# Altium schematic sheet EMI Schematic.SchDoc
size A4; SheetNumber: 1; SheetTotal: 1
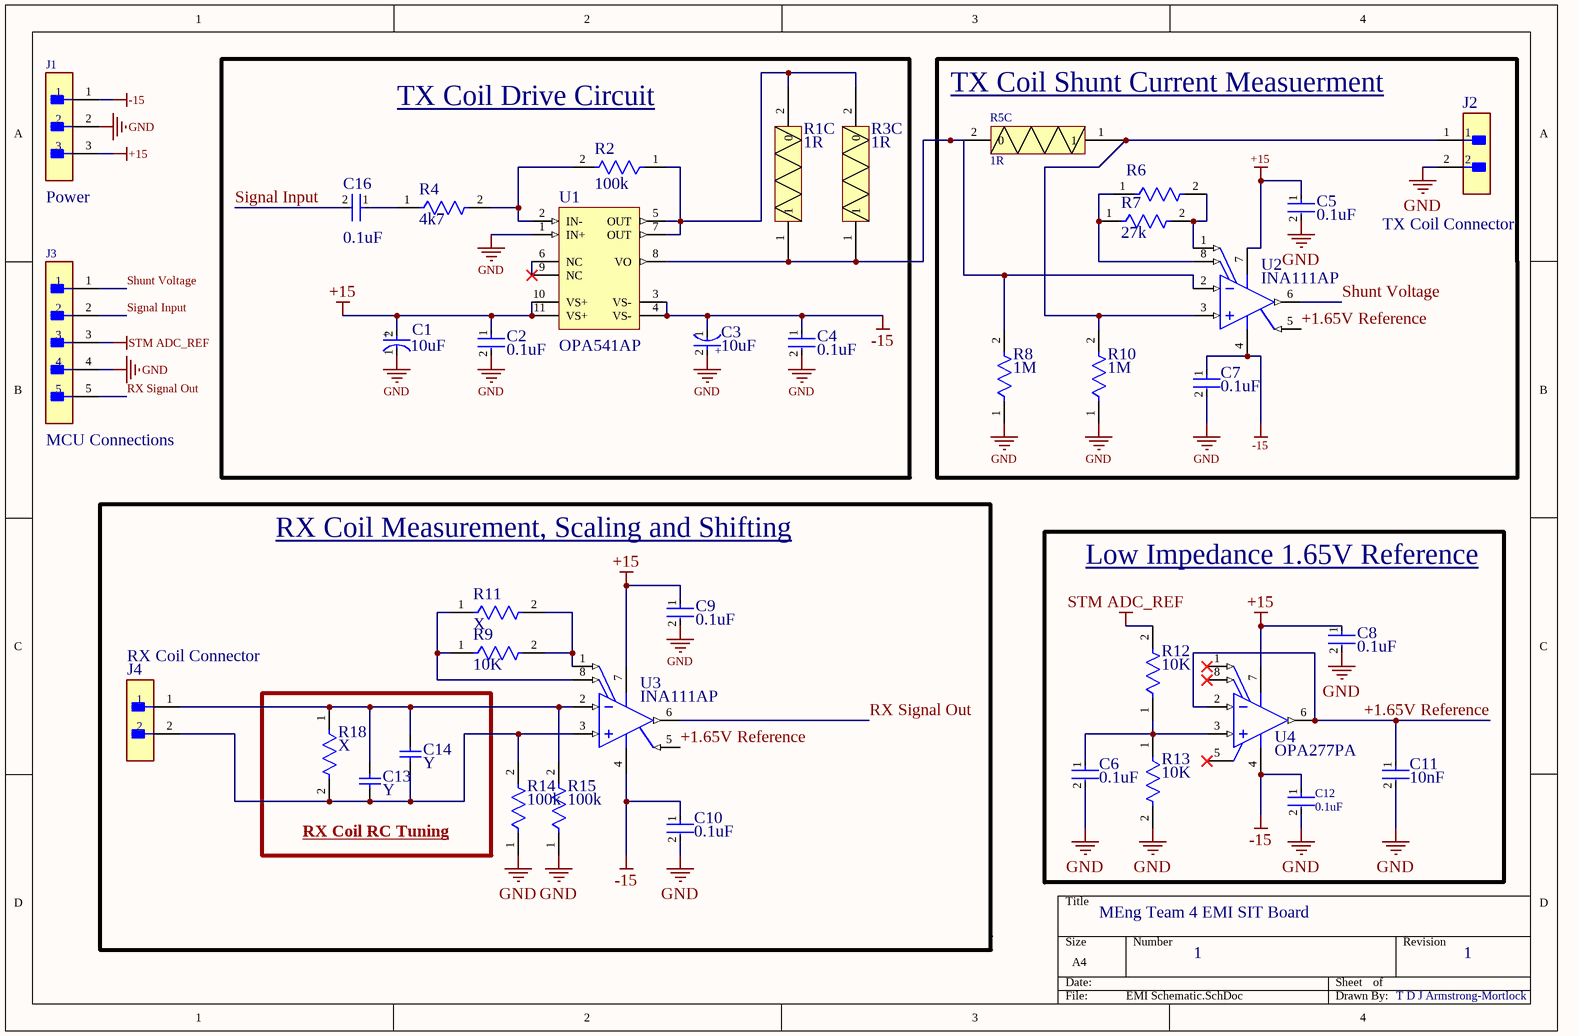
[diagram p0: EMI Schematic.SchDoc]

## Parts
C1  10uF  [FP-RAD-TH-D_5_0_5-L_11_1-MFG]
C2  0.1uF  [FP-K15H5-MFG]
C3  10uF  [FP-RAD-TH-D_5_0_5-L_11_1-MFG]
C4  0.1uF  [FP-K15H5-MFG]
C5  0.1uF  [FP-K15H5-MFG]
C6  0.1uF  [FP-K15H5-MFG]
C7  0.1uF  [FP-K15H5-MFG]
C8  0.1uF  [FP-K15H5-MFG]
C9  0.1uF  [FP-K15H5-MFG]
C10  0.1uF  [FP-K15H5-MFG]
C11  10nF  [FP-K15H5-MFG]
C12  0.1uF  [FP-K15H5-MFG]
C13  Y  [CAPC2013X145X48ML20T23]
C14  Y  [CAPC2013X145X48ML20T23]
C16  0.1uF  [FP-K15H5-MFG]
J1  Power  [FP-09-65-2038-MFG]
J2  TX Coil Connector  [FP-26-61-4020-MFG]
J3  MCU Connections  [FP-22-28-4050-MFG]
J4  RX Coil Connector  [FP-26-61-4020-MFG]
R1  1R  [PRO3 0617]  (part C of 3)
R2  100k  [FP-RT0805-MFG]
R3  1R  [PRO3 0617]  (part C of 3)
R4  4k7  [FP-RT0805-MFG]
R5  1R  [PRO3 0617]  (part C of 3)
R6  (no value)  [FP-RT0805-MFG]
R7  27k  [FP-RT0805-MFG]
R8  1M  [FP-RT0805-MFG]
R9  10K  [FP-RT0805-MFG]
R10  1M  [FP-RT0805-MFG]
R11  X  [FP-RT0805-MFG]
R12  10K  [FP-RT0805-MFG]
R13  10K  [FP-RT0805-MFG]
R14  100k  [FP-RT0805-MFG]
R15  100k  [FP-RT0805-MFG]
R18  X  [FP-RT0805-MFG]
U1  OPA541AP  [KV0011A]
U2  INA111AP  [P0008A]
U3  INA111AP  [P0008A]
U4  OPA277PA  [P0008A]

## Blocks framed on the sheet
TX Coil Drive Circuit: C1-C4 C16 R1-R4 U1
TX Coil Shunt Current Measuerment: C5 C7 J2 R5-R8 R10 U2
RX Coil Measurement, Scaling and Shifting: C9 C10 J4 R9 R11 R14 R15 U3
Low Impedance 1.65V Reference: C6 C8 C11 C12 R12 R13 U4
RX Coil RC Tuning: C13 C14 R18

## Nets
+15: C1.2(A) C2.1 C5.1 C8.1 C9.1 J1.3 U1.10(VS+) U1.11(VS+) U2.7(V+) U3.7(V+) U4.7(V+)
-15: C3.1(C) C4.1 C7.1 C10.1 C12.1 J1.1 U1.3(VS-) U1.4(VS-) U2.4(V-) U3.4(V-) U4.4(V-)
GND: C1.1(C) C2.2 C3.2(A) C4.2 C5.2 C6.2 C7.2 C8.2 C9.2 C10.2 C11.2 C12.2 J1.2 J2.2 J3.4 R8.1 R10.1 R13.2 R14.1 R15.1 U1.1(IN+)
STM ADC_REF: J3.3 R12.2
+1.65V Reference: C11.1 U2.5(REF) U3.5(REF) U4.2(IN-) U4.6(OUT)
RX Signal Out: J3.5 U3.6(VO)
Shunt Voltage: J3.1 U2.6(VO)
Signal Input: C16.2 J3.2
NetC6_1: C6.1 R12.1 R13.1 U4.3(IN+)
NetC13_1: C13.1 C14.1 J4.1 R15.2 R18.1 U3.2(VIN-)
NetC13_2: C13.2 C14.2 J4.2 R14.2 R18.2 U3.3(VIN+)
NetC16_1: C16.1 R4.1
NetJ2_1: J2.1 R5.1 R10.2 U2.3(VIN+)
NetR1_1: R1.1 R3.1 R5.2(0) R8.2 U1.8(VO) U2.2(VIN-)
NetR1_2: R1.2(0) R2.1 R3.2(0) U1.5(OUT) U1.7(OUT)
NetR2_2: R2.2 R4.2 U1.2(IN-)
NetR6_1: R6.1 R7.1 U2.8(RG)
NetR6_2: R6.2 R7.2 U2.1(RG)
NetR9_1: R9.1 R11.1 U3.8(RG)
NetR9_2: R9.2 R11.2 U3.1(RG)
NetU1_6: U1.6(NC) U1.9(NC)

Not connected (* = marked no-connect by the designer): U4 1(OFFSET_TRIM)* 5(NC)* 8(OFFSET_TRIM)*

## Notes on the sheet
- MEng Team 4 EMI SIT Board
- 1
- T D J Armstrong-Mortlock
- (in symbol CMP-05427-000260-1) +

## Library data of the parts
C1 C3 = CMP-05427-000260-1: Aluminum Electrolytic Capacitors (Radial Lead Type) AEC-Q200 Qualified 10uF ±20% 50V; Lead Diameter: 0.5mm; Polarity: Polar; Leakage Current: 3uA; Life (Hours): 1000Hour; Ripple Current: 39mA; Lead/Base Style: Straight; Max Operating Temperature: 105°C; Voltage Rating (DC): 50V; Diameter: 5mm; RoHS Compliant: Yes; Capacitance: 10uF; Packaging: Ammo Pack; Series: NHG; Construction: RADIAL; Length: 11mm; Tolerance: 20%; Height - Seated (Max): 0.472inch; Contact Plating: Tin; Height: 11mm; Min Operating Temperature: -55°C; Radiation Hardening: No; Package Quantity: 2000; Mount: Through Hole; Voltage Rating: 50V; Lead Pitch: 2.5mm; Termination: Radial; Lead Free: Lead Free; Case/Package: Radial
C2 C4-C12 C16 = CMP-02417-000048-1: CAP CER 0.1UF 50V X7R RADIAL; Capacitance: 100nF; Tolerance: 10%; Lead/Base Style: Formed Leads; Lead Length: 30mm; Lead Diameter: 0.5mm; Radiation Hardening: No; Lead Pitch: 5mm; Voltage: 50V; Mount: Through Hole; Package Quantity: 5000; Series: K; Case/Package: Dipped; Min Operating Temperature: -55°C; Depth: 2.5mm; Height - Seated (Max): 0.1inch; Voltage Rating (DC): 50V; Packaging: Bulk; RoHS Compliant: Yes; Construction: RADIAL; Thickness: 2.6mm; Max Operating Temperature: 125°C; Voltage Rating: 50V; Diameter: 500um; Dielectric: X7R; Width: 2.5mm; Length: 4mm; Weight: 0.005644oz; Termination: Radial; Height: 4mm
C13 C14 = CMP-2007-03205-1: Manufacturer: Vitramon; Part Number: VJ0805Y682KXAMT
J1 = CMP-04776-000251-1: CONN HEADER VERT 3POS 3.96MM; Max Voltage Rating (AC): 250V; Gender: Male; Glow Wire Compliant: Non-compliant; Number of Contacts: 3; Contact Resistance: 10mR; Current Rating: 7A; Mating Cycles: 30; Pitch: 3.96mm; Radiation Hardening: No; Lead Free: Lead Free; Termination: Through Hole; Orientation: Straight; Housing Material: Nylon; RoHS Compliant: Yes; Number of Rows: 1; Color: Natural; Contact Material: Brass; Voltage Rating: 250V; Flammability Rating: UL94 V-2; Contact Gender: Male; Number of Positions: 3; Min Operating Temperature: -40°C; Package Quantity: 8000; Packaging: Bulk; Mount: Through Hole; Series: 5273; Contact Plating: Tin; Max Operating Temperature: 105°C; Halogen Free: Halogen Free; Housing Color: Natural; Voltage Rating (DC): 250V
J2 J4 = CMP-00257-00277943-1: 26-61-4020 3.96mm (.156") Pitch KK® Solid Header, Vertical, Friction Lock, 2 Circuits, Gold (Au) Plating; NexarPartId: 277943; Manufacturer Lifecycle Status: ACTIVE; Number of Positions: 2; Contact Resistance: 6mΩ; Voltage Rating (DC): 250V; Glow Wire Compliant: Non-compliant; Max Current Rating: 7A; Insulation Resistance: 50GΩ; Gender: Male; Pitch: 3.96mm; Orientation: Right Angle, Vertical; Number of Circuits: 2; Length: 7.77mm; Depth: 10.01mm; Min Operating Temperature: 0°C; Mount: Through Hole; Lifecycle Status: Production; Lead Pitch: 3.96mm; Packaging: Bulk; Voltage Rating: 250V; Flammability Rating: UL94 V-0; Schedule B: 8536694040; Country of Origin: US; Contact Plating: Gold; Housing Color: Natural; Lead Free: Lead Free; Housing Material: Polyester; RoHS: Compliant; Color: Natural; Contact Material: Brass; REACH SVHC: Unknown; Number of Contacts: 2; Number of Rows: 1; Height: 14.73mm; Current Rating: 7A; Termination: Solder; Max Operating Temperature: 75°C; Max Voltage Rating (AC): 250V; Radiation Hardening: No
J3 = CMP-00257-00278173-1: 22-28-4050 KK® 254 Breakaway Header, Vertical, 5 Circuits, Tin (Sn) Plating, Mating Pin Length 6.09mm; NexarPartId: 278173; Voltage Rating: 250V; Number of Contacts: 5; Contact Resistance: 20mΩ; Gender: Male; Pitch: 2.54mm; Connector Type: Male Pin; Current Rating: 4A; Glow Wire Compliant: Non-compliant; Max Voltage Rating (DC): 250.25kV; Flammability Rating: UL94 V-0; Min Operating Temperature: 0°C; REACH SVHC: Unknown; Lead Free: Lead Free; Termination: Solder; RoHS: Compliant; Schedule B: 8536694040; Number of Circuits: 5; Mount: Through Hole; Lead Pitch: 2.54mm; Height: 2.29mm; Voltage Rating (DC): 250V; Max Operating Temperature: 75°C; Width: 2.49mm; Radiation Hardening: No; Contact Plating: Tin; Orientation: Vertical; Length: 12.7mm; Number of Rows: 1; Housing Material: Thermoplastic; Contact Material: Brass; Packaging: Bulk; Contact Mating Length: 6.096mm; Housing Color: Black; Color: Black; Number of Positions: 5
R1 R3 R5 = R?: 1 ohm 3w
R2 R4 R6-R15 R18 = CMP-03412-002763-1: RES SMD 681 OHM 0.1% 1/8W 0805; Manufacturer: Yageo; Manufacturer Part Number: RT0805BRD07681RL; Value: 681Ω; Temperature Coefficient: 25 ppm/°C; Power Rating: 0.125W; Voltage Rating: 150V; Tolerance: 0.0025; ComponentLink2URL: http://www.yageo.com/documents/recent/PYu-RT_1-to-0.01_RoHS_L_9.pdf; Ipc Land Pattern Name: RESC200125X50; Footprint Url: http://www.yageo.com/exep/pages/download/literatures/PYu-R_Mount_10.pdf; Temperature: -55°C to +155°C; Resistance: 681Ω; Mouser Description: Thin Film Resistors - SMD 1/8W 681 ohm .1% 25ppm; Temperature Range High: +155°C; Device Class L3: Chip SMD Resistors; Automotive: No; Octopart: https://octopart.com/rt0805brd07681rl-yageo-1270194; Device Class L1: Passive Components; Package: RT0805; Device Class L2: Resistors; Category: Res; RoHS: TRUE; Composition: Thin Film; ComponentLink2Description: Datasheet; Temperature Range Low: -55°C; Lead Free: Yes; Digikey Description: RES SMD 681 OHM 0.1% 1/8W 0805; Height: 0.6mm; Series: RT
U1 = CMP-0272-03690-4: High Power Monolithic Operational Amplifier, 20 to 70 V, -25 to 85 degC, 11-pin FM (KV11), Green (RoHS & no Sb/Br); Manufacturer: Texas Instruments; Rating: Catalog; Packing: TUBE; Slew Rate(Typ)(V/us): 10; GBW(Typ)(MHz): 1.6; Total Supply Voltage(Max)(+5V is 5, +/-5V is 10): 70; Number of Channels: 1; Sub Family: High Output Current Amplifier (>=50mA), High Supply Voltage Amplifier (>=30V), Precision Amplifier; Offset Drift(Typ)(uV/C): 20; IIB(Max)(pA): 50; CMRR(Min)(dB): 95; Iq per channel(Max)(mA): 25; ComponentLink2URL: http://www.ti.com/lit/ds/symlink/opa541.pdf; ComponentLink1URL: http://www.ti.com/; PartNumber: OPA541AP; PackageReference: KV0011A; PackageDescription: 11-Pin Plastic Flange Mount, Body 20.015 x 4.495 mm, Pitch 1.7 mm; ComponentLink1Description: Manufacturer URL; DatasheetVersion: SBOS153A; Total Supply Voltage(Min)(+5V is 5, +/-5V is 10): 20; ComponentLink2Description: Datasheet; Vio (25C)(Max)(mV): 10; Eco-Plan: Green (RoHS & no Sb/Br); Code_JEDEC: MO-48-AA; Mounting Technology: Through Hole
U2 U3 = CMP-0992-00142-2: High Speed FET-Input Instrumentation Amplifier, -40 to 85 degC, 8-pin DIP (P8), Green (RoHS & no Sb/Br); Manufacturer: Texas Instruments; SubFamily: Dual Supply; Input Offset Drift (+/-)(Max)(uV/Degrees Celsius): 10; Number of Channels: 1; Input Offset (+/-)(Max)(uV): 1000; Input Bias Current (+/-)(Max)(nA): 0.02; Quiescent Current (+/-)(Typ)(mA): 3.3; Non-Linearity (+/-)(Max)(%): 0.01; Gain(V/V): 1 to 10000; Vs(Min)(V): 12; Vs(Max)(V): 36; CMRR(Min)(dB): 100; Code_JEDEC: MS-001; ComponentLink1URL: http://www.ti.com/; Noise at 1kHz(Typ)(nV/rt(Hz)): 10; PackageReference: P0008A; PartNumber: INA111AP; ComponentLink1Description: Manufacturer URL; ComponentLink3Description: Package Specification; PackageVersion: 4040082/E, 04/2010; Eco-Plan: Green (RoHS & no Sb/Br); ComponentLink2URL: http://www.ti.com/general/docs/lit/getliterature.tsp?genericPartNumber=INA111&fileType=pdf; DatasheetVersion: SBOS015; Mounting Technology: Through Hole; PackageDescription: 8-Pin Plastic In-Line, Body 9.59 x 6.35 mm, Pitch 2.54 mm; ComponentLink2Description: Datasheet; ComponentLink3URL: http://www.ti.com/litv/pdf/mpdi001b
U4 = CMP-0272-01522-3: High Precision Operational Amplifier, 4 to 36 V, -55 to 125 degC, 8-pin DIP (P8), Green (RoHS & no Sb/Br); Manufacturer: Texas Instruments; Iq per channel(Max)(mA): 0.825; Vio (25C)(Max)(mV): 0.05; Total Supply Voltage(Max)(+5V is 5, +/-5V is 10): 36; Rating: Catalog; Number of Channels: 1; Offset Drift(Typ)(uV/C): 0.15; IIB(Max)(pA): 2800; Sub Family: High Supply Voltage Amplifier (>=30V), Low Noise Amp (<=10nV/rtHz), Low Offset Voltage Amplifier (<=500uV), Precision Amplifier; CMRR(Min)(dB): 115; Slew Rate(Typ)(V/us): 0.8; Packing: TUBE; Total Supply Voltage(Min)(+5V is 5, +/-5V is 10): 4; ComponentLink3URL: http://www.ti.com/litv/pdf/mpdi001b; ComponentLink3Description: Package Specification; PackageReference: P0008A; ComponentLink2Description: Datasheet; PackageDescription: 8-Pin Plastic In-Line, Body 9.59 x 6.35 mm, Pitch 2.54 mm; GBW(Typ)(MHz): 1; Eco-Plan: Green (RoHS & no Sb/Br); Mounting Technology: Through Hole; Code_JEDEC: MS-001; DatasheetVersion: SBOS079A; ComponentLink1URL: http://www.ti.com/; PartNumber: OPA277PA; ComponentLink1Description: Manufacturer URL; ComponentLink2URL: http://www.ti.com/lit/ds/symlink/opa277.pdf; PackageVersion: 4040082/E, 04/2010